# EAGLE design fan-interface-v1.0 (EAGLE 9.6.2)
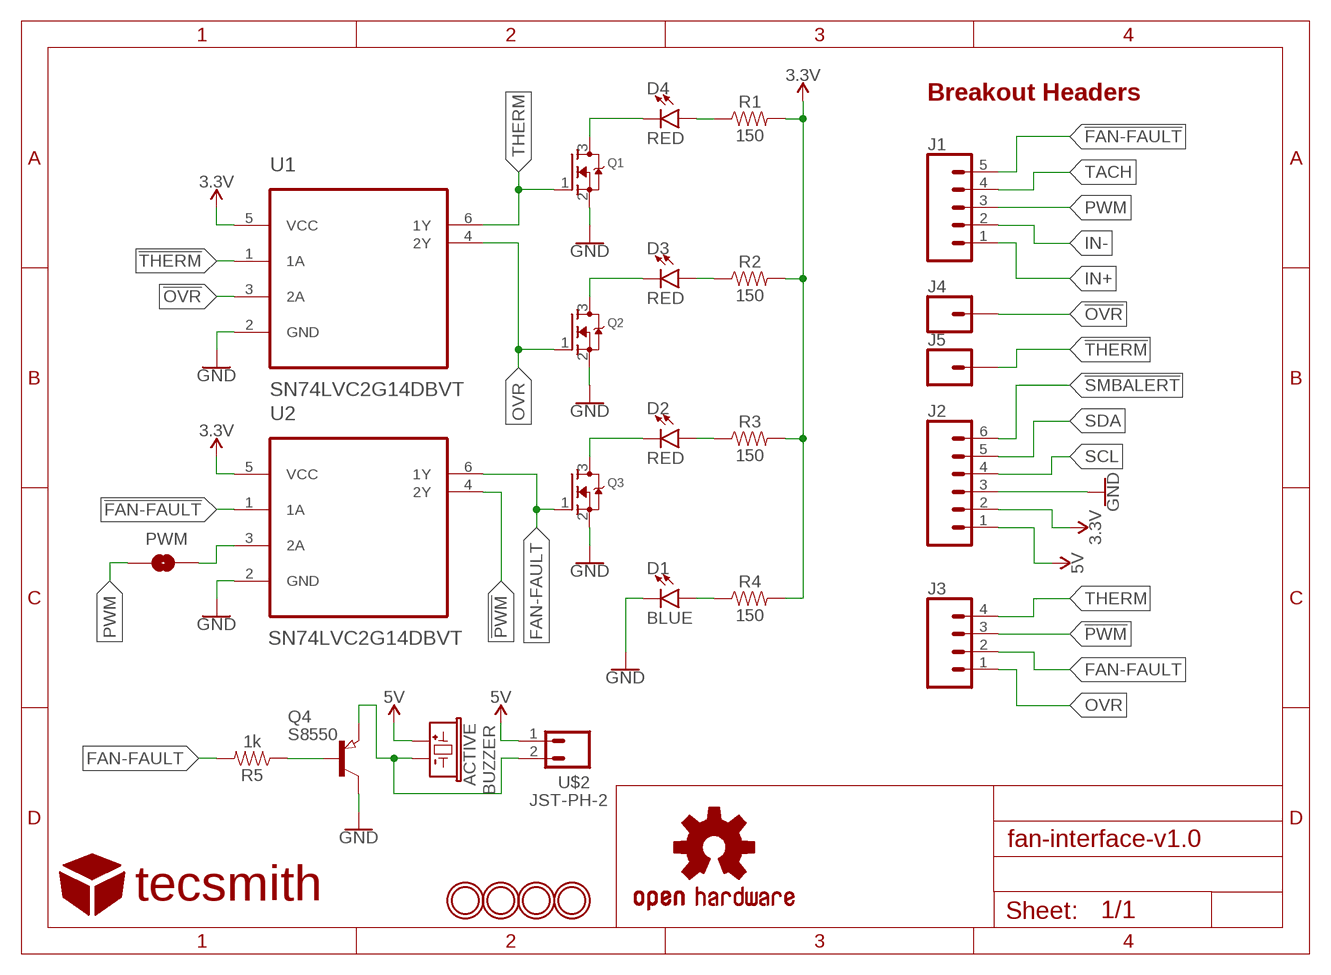
[diagram p0: schematic, sheet 1]

## Parts
ACTIVE  BUZZER  [BUZZER-SMD]
D1  BLUE  LED-BLUE0603  [LED-0603]
D2  RED  LED-RED0603  [LED-0603]
D3  RED  LED-RED0603  [LED-0603]
D4  RED  LED-RED0603  [LED-0603]
J1  CONN_05  [1X05]
J2  CONN_06SILK_FEMALE_PTH  [1X06]
J3  CONN_04PTH  [1X04]
J4  CONN_01  [1X01]
J5  CONN_01  [1X01]
LOGO1  OSHW-LOGOS  [OSHW-LOGO-S]
PWM  JUMPER-SMT_2_NO_SILK  [SMT-JUMPER_2_NO_SILK]
Q1  MOSFET-NREFLOW  [SOT23]
Q2  MOSFET-NREFLOW  [SOT23]
Q3  MOSFET-NREFLOW  [SOT23]
Q4  S8550  PNP-TRANSISTOR_SOT23  [SOT23]
R1  150  150OHM-0603-1/10W-1%  [0603]
R2  150  150OHM-0603-1/10W-1%  [0603]
R3  150  150OHM-0603-1/10W-1%  [0603]
R4  150  150OHM-0603-1/10W-1%  [0603]
R5  1k  1KOHM-0603-1/10W-1%  [0603]
U1  SN74LVC2G14DBVT  [SOT95P280X145-6N]
U2  SN74LVC2G14DBVT  [SOT95P280X145-6N]
U$1  TECSMITH-LOGO  [TECSMITH-LOGO]
U$2  JST-PH-2  [JST-PH2]
U$7  MOUNTINGHOLE2.5  [MOUNTINGHOLE_2.5_PLATED]
U$8  MOUNTINGHOLE2.5  [MOUNTINGHOLE_2.5_PLATED]
U$9  MOUNTINGHOLE2.5  [MOUNTINGHOLE_2.5_PLATED]
U$10  MOUNTINGHOLE2.5  [MOUNTINGHOLE_2.5_PLATED]

## Nets
3.3V: J2.2 R1.2 R2.2 R3.2 R4.2 U1.5(VCC) U2.5(VCC)
5V: ACTIVE.+ ACTIVE.+1 J2.1 U$2.1
!FAN-FAULT: J1.5 U2.1(1A)
!OVR: J4.1 U1.3(2A)
!PWM: J3.3 U2.4(2Y)
!SMBALERT: J2.6
!THERM: J5.1 U1.1(1A)
FAN-FAULT: J3.2 Q3.1(G) R5.2 U2.6(1Y)
GND: D1.C J2.3 Q1.2(S) Q2.2(S) Q3.2(S) Q4.3(C) U1.2(GND) U2.2(GND)
IN+: J1.1
IN-: J1.2
N$2: D4.C Q1.3(D)
N$3: D4.A R1.1
N$4: D3.A R2.1
N$5: D3.C Q2.3(D)
N$6: PWM.2 U2.3(2A)
N$7: Q4.1(B) R5.1
N$8: D2.A R3.1
N$9: D2.C Q3.3(D)
N$10: D1.A R4.1
N$11: ACTIVE.- ACTIVE.-1 Q4.2(E) U$2.2
OVR: J3.1 Q2.1(G) U1.4(2Y)
PWM: J1.3 PWM.1
SCL: J2.4
SDA: J2.5
TACH: J1.4
THERM: J3.4 Q1.1(G) U1.6(1Y)

## Notes on the sheet
- Breakout Headers

## Library data of the parts
ACTIVE = VinoRodrigues_Custom_Eagle:BUZZER: Buzzer Small round buzzers that operate around the audible 2kHz range. You can use these as speakers to create simple music or user interfaces. Variant Overview: PTH - Mini Speaker - PC Mount 12mm 2.048kHz <https://www.sparkfun.com/products/7950> PTH_KIT - Mini Speaker - PC Mount 12mm 2.048kHz <https://www.sparkfun.com/products/7950> KIT simplifies soldering by adding stop mask to one side of the pads. PTH_NO_SILK - Mini Speaker - PC Mount 12mm 2.048kHz <https://www.sparkfun.com/products/7950> No silkscreen indicator of buzzer outline. PTH_KIT_NO_SILK - Mini Speaker - PC Mount 12mm 2.048kHz <https://www.sparkfun.com/products/7950> KIT package w/o silkscreen SMD - Buzzer Audio Magnetic (CCV-084B16) SMD buzzer used on, e.g. the LilyPad Buzzer <https://www.sparkfun.com/products/8463> and RFID USB Reader <https://www.sparkfun.com/products/9963>. SMD_KIT - Buzzer Audio Magnetic (CCV-084B16) SMD Buzzer with elongated pins to make soldering easier. Used on the SparkFun Simon Says - Surface Mount Soldering Kit <https://www.sparkfun.com/products/10935>.
D1 = SparkFun-LED:LED-BLUE: Blue SMD LED Used in manufacturing of various products at SparkFun Packages: 0603 - SMD 0603 package [Product Link] <http://www.digikey.com/product-detail/en/SMLE12BC7TT86/511-1589-2-ND/1641808> 1206 - SMD1206 package [Product Link] <http://www.digikey.com/product-detail/en/lite-on-inc/LTST-C150TBKT/160-1643-1-ND/573584> SparkFun Products: ESP8266 Thing-Dev Board <https://www.sparkfun.com/products/13711> RedBoard <https://www.sparkfun.com/products/12757>; PROD_ID: DIO-08575
D2-D4 = SparkFun-LED:LED-RED: Red SMD LED Used in manufacturing of most products at SparkFun Packages: 0603 - SMD 0603 package [Product Link] <http://docs.avagotech.com/docs/AV02-0551EN> 0603 SMART - SMD 0603 SMART package ( more efficient and expensive)[Product Link] <http://www.osram-os.com/Graphics/XPic2/00077099_0.pdf> 1206 - SMD1206 package [Product Link] <https://www.sparkfun.com/datasheets/DevTools/LilyPad/Q150OVS4.pdff> SparkFun Products: Pro Mini 328 -5V <https://www.sparkfun.com/products/821> RedBoard <https://www.sparkfun.com/products/12757> IOIO-OTG <https://www.sparkfun.com/products/13613>; PROD_ID: DIO-00819
J1 = SparkFun-Connectors:CONN_05: Multi connection point. Often used as Generic Header-pin footprint for 0.1 inch spaced/style header connections On any of the 0.1 inch spaced packages, you can populate with these: Break Away Headers - Straight <https://www.sparkfun.com/products/116> (PRT-00116) Break Away Male Headers - Right Angle <https://www.sparkfun.com/products/553> (PRT-00553) Female Headers <https://www.sparkfun.com/products/115> (PRT-00115) Break Away Headers - Machine Pin <https://www.sparkfun.com/products/117> (PRT-00117) Break Away Female Headers - Swiss Machine Pin <https://www.sparkfun.com/products/743> (PRT-00743) For SCREWTERMINALS and SPRING TERMINALS visit here: Screw Terimnals on SparkFun.com <https://www.sparkfun.com/search/results?term=Screw+Terminals> (5mm/3.5mm/2.54mm spacing) This device is also useful as a general connection point to wire up your design to another part of your project. Our various solder wires solder well into these plated through hole pads. Hook-Up Wire - Assortment (Stranded, 22 AWG) <https://www.sparkfun.com/products/11375> (PRT-11375) Hook-Up Wire - Assortment (Solid Core, 22 AWG) <https://www.sparkfun.com/products/11367> (PRT-11367) View the entire wire category on our website here <https://www.sparkfun.com/categories/141> Special notes: Molex polarized connector foot print use with SKU : PRT-08231 with associated crimp pins and housings. 1MM SMD Version SKU: PRT-10208
J2 = SparkFun-Connectors:CONN_06: Multi connection point. Often used as Generic Header-pin footprint for 0.1 inch spaced/style header connections On any of the 0.1 inch spaced packages, you can populate with these: Break Away Headers - Straight <https://www.sparkfun.com/products/116> (PRT-00116) Break Away Male Headers - Right Angle <https://www.sparkfun.com/products/553> (PRT-00553) Female Headers <https://www.sparkfun.com/products/115> (PRT-00115) Break Away Headers - Machine Pin <https://www.sparkfun.com/products/117> (PRT-00117) Break Away Female Headers - Swiss Machine Pin <https://www.sparkfun.com/products/743> (PRT-00743) Arduino Stackable Header - 6 Pin <https://www.sparkfun.com/products/9280> (PRT-09280) For SCREWTERMINALS and SPRING TERMINALS visit here: Screw Terimnals on SparkFun.com <https://www.sparkfun.com/search/results?term=Screw+Terminals> (5mm/3.5mm/2.54mm spacing) This device is also useful as a general connection point to wire up your design to another part of your project. Our various solder wires solder well into these plated through hole pads. Hook-Up Wire - Assortment (Stranded, 22 AWG) <https://www.sparkfun.com/products/11375> (PRT-11375) Hook-Up Wire - Assortment (Solid Core, 22 AWG) <https://www.sparkfun.com/products/11367> (PRT-11367) View the entire wire category on our website here <https://www.sparkfun.com/categories/141>; PROD_ID: CONN-08437
J3 = SparkFun-Connectors:CONN_04: Multi connection point. Often used as Generic Header-pin footprint for 0.1 inch spaced/style header connections On any of the 0.1 inch spaced packages, you can populate with these: Break Away Headers - Straight <https://www.sparkfun.com/products/116> (PRT-00116) Break Away Male Headers - Right Angle <https://www.sparkfun.com/products/553> (PRT-00553) Female Headers <https://www.sparkfun.com/products/115> (PRT-00115) Break Away Headers - Machine Pin <https://www.sparkfun.com/products/117> (PRT-00117) Break Away Female Headers - Swiss Machine Pin <https://www.sparkfun.com/products/743> (PRT-00743) For SCREWTERMINALS and SPRING TERMINALS visit here: Screw Terimnals on SparkFun.com <https://www.sparkfun.com/search/results?term=Screw+Terminals> (5mm/3.5mm/2.54mm spacing) This device is also useful as a general connection point to wire up your design to another part of your project. Our various solder wires solder well into these plated through hole pads. Hook-Up Wire - Assortment (Stranded, 22 AWG) <https://www.sparkfun.com/products/11375> (PRT-11375) Hook-Up Wire - Assortment (Solid Core, 22 AWG) <https://www.sparkfun.com/products/11367> (PRT-11367) View the entire wire category on our website here <https://www.sparkfun.com/categories/141> Special notes: Molex polarized connector foot print use with SKU : PRT-08231 with associated crimp pins and housings. 1MM SMD Version SKU: PRT-10208; PROD_ID: CONN-09696
J4 J5 = SparkFun-Connectors:CONN_01: Single connection point. Often used as Generic Header-pin footprint for 0.1 inch spaced/style header connections On any of the 0.1 inch spaced packages, you can populate with these: Break Away Headers - Straight <https://www.sparkfun.com/products/116> (PRT-00116) Break Away Male Headers - Right Angle <https://www.sparkfun.com/products/553> (PRT-00553) Female Headers <https://www.sparkfun.com/products/115> (PRT-00115) Break Away Headers - Machine Pin <https://www.sparkfun.com/products/117> (PRT-00117) Break Away Female Headers - Swiss Machine Pin <https://www.sparkfun.com/products/743> (PRT-00743) This device is also useful as a general connection point to wire up your design to another part of your project. Our various solder wires solder well into these plated through hole pads. Hook-Up Wire - Assortment (Stranded, 22 AWG) <https://www.sparkfun.com/products/11375> (PRT-11375) Hook-Up Wire - Assortment (Solid Core, 22 AWG) <https://www.sparkfun.com/products/11367> (PRT-11367) View the entire wire category on our website here <https://www.sparkfun.com/categories/141> Special notes: SMTSO-256-ET is a "flush mount" nut for a 4-40 screw. We mostly use this on specialty testbeds; it is a nice way to connect hardware to your PCB at an adjustable hieght. Also note, the SNAP packages are for using a snappable style connector. We sell a baggie of snaps and they are also used on two LilyPad designs: Snap Assortment - 30 pack (male and female) <https://www.sparkfun.com/products/11347> (DEV-11347) LilyPad Arduino SimpleSnap <https://www.sparkfun.com/products/10941> (DEV-10941) LilyPad SimpleSnap Protoboard <https://www.sparkfun.com/products/10940> (DEV-10940)
LOGO1 = SparkFun-Aesthetics:OSHW-LOGO: Open-Source Hardware (OSHW) Logo This logo indicates the piece of hardware it is found on incorporates a OSHW license and/or adheres to the definition of open source hardware found here: http://freedomdefined.org/OSHW
PWM = SparkFun-Jumpers:JUMPER-SMT_2_NO: Normally open jumper This jumper has two pads in close proximity to each other. Apply solder to close the connection. Round pads are easier to solder for beginners, but are a lot larger. SparkFun Product that uses the round pads: SparkFun EL Sequencer <https://www.sparkfun.com/products/12781>
Q1-Q3 = adafruit:MOSFET-N: N-Channel Mosfet 2N7002E - 60V 260mA SOT23 [Digikey: 2N7002ET1GOSTR-ND] - REEL BSH103 - 30V 850mA SOT23 [Digikey: 568-5013-1-ND]
Q4 = semicon-smd-ipc:PNP-TRANSISTOR_: PNP TRANSISTOR
R1-R4 = SparkFun-Resistors:150OHM: 150Ω resistor A resistor is a passive two-terminal electrical component that implements electrical resistance as a circuit element. Resistors act to reduce current flow, and, at the same time, act to lower voltage levels within circuits. - Wikipedia; PROD_ID: RES-11028
R5 = SparkFun-Resistors:1KOHM: 1kΩ resistor A resistor is a passive two-terminal electrical component that implements electrical resistance as a circuit element. Resistors act to reduce current flow, and, at the same time, act to lower voltage levels within circuits. - Wikipedia; PROD_ID: RES-07856
U1 U2 = Texas Instruments_By_element14_Batch_1:SN74LVC2G14DBVT: SN74LVC2G14 DUAL SCHMITT-TRIGGER INVERTER; MPN: SN74LVC2G14DBVT; OC_FARNELL: 1740048; OC_NEWARK: 34R8933; PACKAGE: SOT-23-6; SUPPLIER: Texas Instruments
U$1 = VinoRodrigues_Custom_Eagle:TECSMITH-LOGO
U$2 = VinoRodrigues_Custom_Eagle:JST-PH-2
U$7-U$10 = microbuilder:MOUNTINGHOLE: Mounting Hole For #2 screws (0.086"/2.18mm width, 0.094"/2.4mm hole) use 2.5mm; BOM: EXCLUDE

## Net classes
1 highpower: width 0.305 mm, drill 0.483 mm
2 lowpower: width 0.254 mm, drill 0.483 mm

## Board
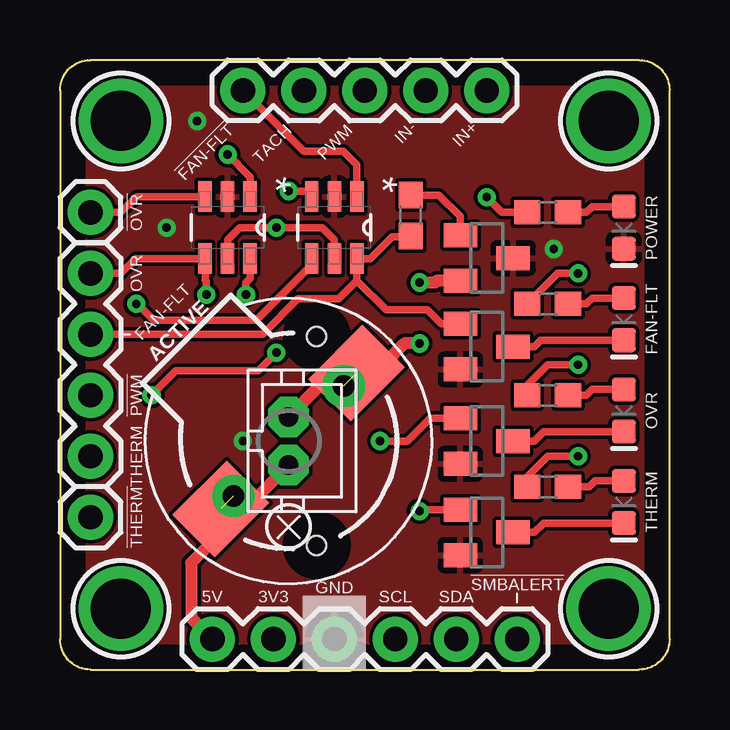
[diagram p1: board, top side]
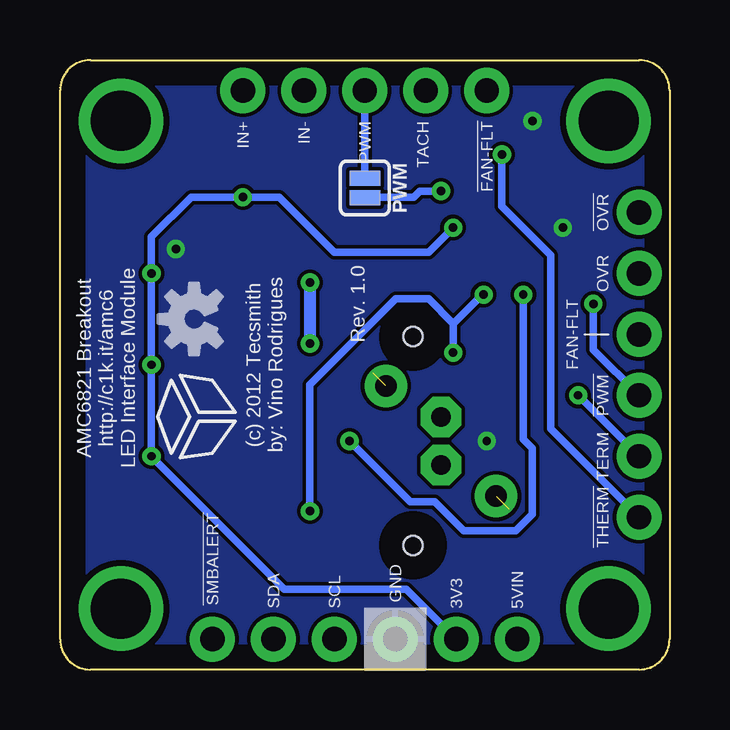
[diagram p2: board, bottom side, seen from below]

Size 25.4 x 25.4 mm. Coordinates in mm from the lower left corner, seen from the top.
Outline: 1.27,0 24.13,0 arc90 25.4,1.27 25.4,24.13 arc90 24.13,25.4 1.27,25.4 arc90 0,24.13 0,1.27 arc90 1.27,0
Copper layers (1*16): Top 0.035mm / dielectric 1.5mm / Bottom 0.035mm
Design rules "default": minimum track width 6mil, minimum drill 0.35mm, track to track 6mil, track to pad 6mil, pad to pad 6mil, via to via 6mil, smd to smd 6mil, copper to edge 40mil, drill to drill 6mil, minimum pad ring 10mil, minimum via ring 8mil, stop-mask expansion 4mil, vias tented up to drill 0mil, thermal gap 10mil

### Footprints (pad centres in the part's own frame; a part is rotated, then mirrored left to right if it is on the bottom)
BUZZER-SMD = smd 3.2 x 2.5: + 4,0; - -4,0 | drill 0.9 pad 1.778: +1 3.25,0; -1 -3.25,0 | hole 0.8: -3.9,-2.25; 2.25,3.9
LED-0603 = smd 1 x 1: A -0.877,0; C 0.877,0
1X05 = drill 1.016 pad 1.88: 1 0,0; 2 2.54,0; 3 5.08,0; 4 7.62,0; 5 10.16,0
1X06 = drill 1.016 pad 1.88: 1 0,0; 2 2.54,0; 3 5.08,0; 4 7.62,0; 5 10.16,0; 6 12.7,0
1X04 = drill 1.016 pad 1.88: 1 0,0; 2 2.54,0; 3 5.08,0; 4 7.62,0
1X01 = drill 1.016 pad 1.88: 1 0,0
SMT-JUMPER_2_NO_SILK = smd 0.635 x 1.27: 1 -0.406,0; 2 0.406,0
SOT23 = smd 1 x 1.4: 1 -0.95,-1.1; 2 0.95,-1.1; 3 0,1.1
0603 = smd 1.1 x 1: 1 -0.85,0; 2 0.85,0
SOT95P280X145-6N = smd 1.27 x 0.559: 1 -1.295,0.94; 2 -1.295,0; 3 -1.295,-0.94; 4 1.295,-0.94; 5 1.295,0; 6 1.295,0.94
JST-PH2 = drill 0.813 pad 1.676 octagon: 1 1,0; 2 -1,0
MOUNTINGHOLE_2.5_PLATED = drill 2.5 pad 3.2: P$1 0,0

### Placement (x,y rotation side)
ACTIVE  9.53,9.53 225 top
D1  23.5,18.41 270 top
D2  23.5,14.61 270 top
D3  23.5,10.79 270 top
D4  23.5,6.99 270 top
J1  17.78,24.13 180 top
J2  6.35,1.27 0 top
J3  1.27,16.51 270 top
J4  1.27,19.05 0 top
J5  1.27,6.35 0 top
LOGO1  19.81,14.61 90 bottom
PWM  12.7,20.07 270 bottom
Q1  17.78,5.71 270 top
Q2  17.78,9.53 270 top
Q3  17.78,13.46 270 top
Q4  17.78,17.14 270 top
R1  20.32,7.62 180 top
R2  20.32,11.43 180 top
R3  20.32,15.24 180 top
R4  20.32,19.05 180 top
R5  14.61,18.92 270 top
U1  6.99,18.41 270 top
U2  11.43,18.41 270 top
U$1  19.81,10.54 90 bottom
U$2  9.53,9.53 270 top
U$7  22.86,2.54 0 top
U$8  22.86,22.86 0 top
U$9  2.54,2.54 0 top
U$10  2.54,22.86 0 top

### Tracks (layer width: path | path; a pad name or v marks a point on that pad's centre or on a via)
3.3V  (via drill 0.35)
  Top 0.305: R1.2 19.47,8.04 20.32,8.89 v21.59,8.89 | v21.59,12.7 20.32,12.7 19.47,11.85 R2.2 | R3.2 20.74,16.51 v21.59,16.51 | v17.78,19.68 18.41,19.05 R4.2 | U1.5 6.99,17.91 7.49,18.41 v9.02,18.41 10.92,18.41 11.43,17.91 U2.5
  Bottom 0.305: J2.2 10.97,3.35 16.05,3.35 v21.59,8.89 v21.59,12.7 v21.59,16.51 21.59,18.03 19.94,19.68 v17.78,19.68 16.26,19.68 13.97,17.4 10.03,17.4 v9.02,18.41
5V  (1 unrouted)
  Top 0.508: J2.1 5.46,2.16 5.46,4.45 7.23,6.21 ACTIVE.+1 8.24,7.23 9.53,8.51 U$2.1
!FAN-FAULT
  Top 0.305: J1.5 10.16,21.59 11.81,21.59 12.37,21.03 U2.1
!OVR
  Top 0.305: U1.3 3.2,19.71 2.54,19.05 J4.1
!PWM  (via drill 0.35)
  Top 0.305: v3.17,15.24 3.23,15.24 3.91,14.56 8.18,14.56 10.49,16.87 U2.4
  Bottom 0.305: v3.17,15.24 3.17,13.34 J3.3
!THERM  (via drill 0.35)
  Top 0.305: v6.99,21.46 7.92,20.52 U1.1
  Bottom 0.305: v6.99,21.46 6.99,19.3 4.95,17.27 4.95,10.03 J5.1
FAN-FAULT
  Top 0.305: Q3.1 15.88,14.41 15.3,14.99 13.59,14.99 12.37,16.2 | 12.37,16.2 U2.6 12.93,17.12 13.84,18.03 14.57,18.03 R5.2 | J3.2 8.44,13.97 9.91,15.44 11.61,15.44 12.37,16.2
GND  (via drill 0.35)
  other vias: 20.57,17.53 7.62,9.53 4.45,18.41 5.71,22.86
  pour Bottom: 0,0 0,25.4 25.4,25.4 25.4,0
  pour Top: 0,0 0,25.4 25.4,25.4 25.4,0
N$2
  Top 0.305: Q1.3 19.77,5.71 20.16,6.11 D4.C
N$3
  Top 0.305: R1.1 22.06,7.62 22.3,7.86 D4.A
N$4
  Top 0.305: R2.1 21.93,11.43 22.17,11.67 D3.A
N$5
  Top 0.305: Q2.3 19.77,9.53 20.16,9.92 D3.C
N$6  (via drill 0.35)
  Top 0.305: U2.3 10.26,19.94 v9.53,19.94
  Bottom 0.305: PWM.2 12.68,19.68 10.67,19.68 10.41,19.94 v9.53,19.94
N$7
  Top 0.305: R5.1 15.79,19.77 16.68,18.88 Q4.1
N$8
  Top 0.305: R3.1 21.93,15.24 22.17,15.48 D2.A
N$9
  Top 0.305: Q3.3 19.77,13.46 20.04,13.73 D2.C
N$10
  Top 0.305: R4.1 21.93,19.05 22.17,19.29 D1.A
N$11  (via drill 0.35)  (1 unrouted)
  Top 0.508: Q4.2 15.69,16.2 15.62,16.13 v14.99,16.13 | v14.99,13.59 14.35,13.59 13.47,12.71 12.71,12.71 ACTIVE.-1 10.81,11.82 9.53,10.54 U$2.2
  Bottom 0.508: v14.99,16.13 v14.99,13.59
OVR  (via drill 0.35)
  Top 0.305: J3.1 2.54,16.51 3.15,17.12 U1.4 6.04,16.23 6.1,16.18 v6.1,15.62 | Q2.1 15.43,10.47 14.48,9.53 v13.34,9.53
  Bottom 0.305: v6.1,15.62 6.1,9.6 5.71,9.22 5.71,6.48 6.41,5.78 8.57,5.78 9.79,7 10.81,7 v13.34,9.53
PWM
  Bottom 0.305: PWM.1 J1.3
THERM  (via drill 0.35)
  Top 0.305: Q1.1 15.05,6.67 v14.99,6.6 | v7.75,15.62 7.75,16.13 7.92,16.31 U1.6 | v3.81,11.43 4.83,12.45 8.26,12.45 v9.02,13.21
  Bottom 0.305: J3.4 v3.81,11.43 | v14.99,6.6 14.99,11.86 11.4,15.44 10.04,15.44 9.02,14.42 | v7.75,15.62 7.81,15.62 9.02,14.42 | v9.02,13.21 9.02,14.42

### Text on the board
tNames: !FAN-FLT | TACH | PWM | IN- | IN+ | !OVR | POWER | OVR | FAN-FLT | FAN-FLT | !PWM | OVR | THERM | THERM | !THERM | 5V | 3V3 | GND | SCL | SDA | !SMBALERT
bNames: !FAN-FLT | TACH | PWM | IN- | IN+ | !OVR | OVR | Rev. 1.0 | FAN-FLT | (c) 2012 Tecsmith / by: Vino Rodrigues | AMC6821 Breakout / http://c1k.it/amc6 / LED Interface Module | !PWM | TERM | !THERM | 5VIN | 3V3 | GND | SCL | SDA | !SMBALERT